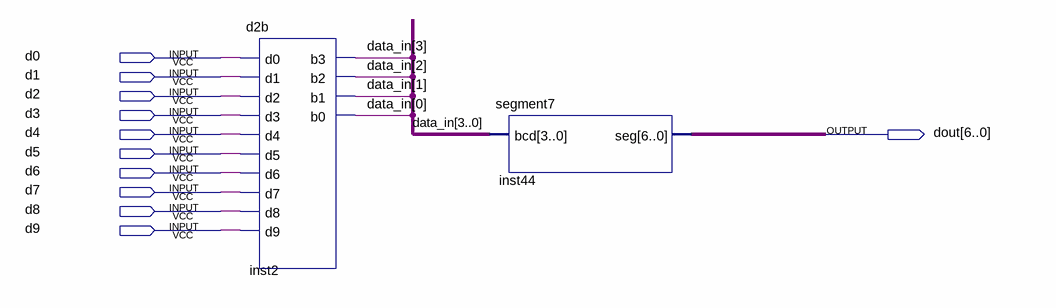
[diagram p0: schematic sheet]
// Quartus schematic assignment10_1.bdf as structural Verilog: 2 symbols, 11 pins
module assignment10_1 (
  input  d0,
  input  d1,
  input  d2,
  input  d3,
  input  d4,
  input  d5,
  input  d6,
  input  d7,
  input  d8,
  input  d9,
  output [6:0] dout
);

  wire [3:0] data_in;

  d2b inst2 (
    .d0(d0), .d1(d1), .d2(d2), .d3(d3), .d4(d4), .d5(d5), .d6(d6), .d7(d7), .d8(d8), .d9(d9),
    .b3(data_in[3]), .b2(data_in[2]), .b1(data_in[1]), .b0(data_in[0]));
  segment7 inst44 (.bcd(data_in), .seg(dout));
endmodule
